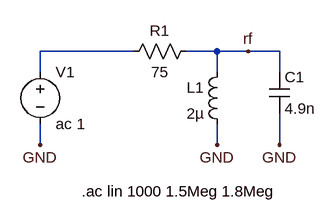
[diagram p0: schematic Draft1.asc]
Draft1.asc, the LTspice schematic file:
Version 4
SHEET 1 1616 1304
WIRE 1456 1216 1456 1184
WIRE 1456 1104 1456 1072
WIRE 1552 1216 1552 1168
WIRE 1552 1104 1552 1072
WIRE 1504 1072 1552 1072
WIRE 1456 1072 1504 1072
WIRE 1408 1072 1456 1072
WIRE 1328 1072 1184 1072
WIRE 1184 1072 1184 1104
WIRE 1184 1184 1184 1216
FLAG 1504 1072 rf
FLAG 1552 1216 GND
FLAG 1456 1216 GND
FLAG 1184 1216 GND
SYMBOL cap 1536 1104 R0
SYMATTR InstName C1
SYMATTR Value 4.9n
SYMBOL ind 1472 1088 M0
SYMATTR InstName L1
SYMATTR Value 2µ
SYMBOL res 1424 1056 R90
WINDOW 0 0 56 VBottom 0
WINDOW 3 32 56 VTop 0
SYMATTR InstName R1
SYMATTR Value 75
SYMBOL voltage 1184 1088 R0
SYMATTR InstName V1
SYMATTR Value ac 1
text 1248 1288 Left 0 !.ac lin 1000 1.5Meg 1.8Meg

The netlist it stands for:
* Draft1.asc
C1 rf GND 4.9n
L1 rf GND 2µ
R1 rf N001 75
V1 N001 GND ac 1
.ac lin 1000 1.5Meg 1.8Meg
.backanno
.end